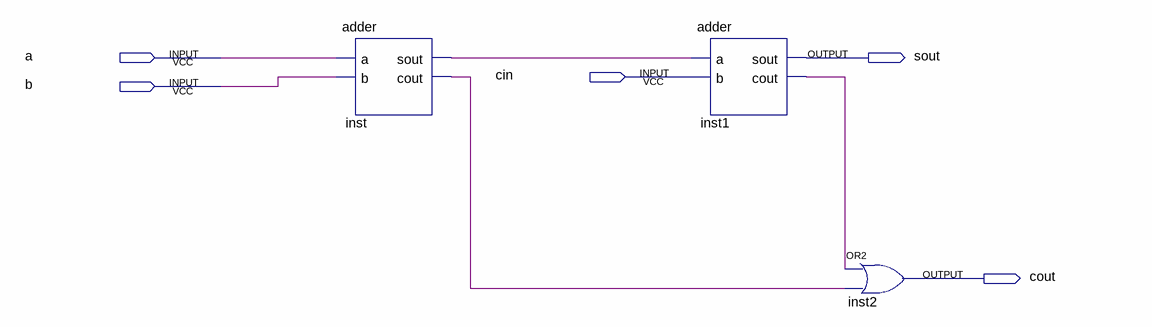
[diagram p0: schematic sheet]
// Quartus schematic f_adder.bdf as structural Verilog: 3 symbols, 5 pins
module f_adder (
  input  a,
  input  cin,
  input  b,
  output sout,
  output cout
);

  wire inst1_cout, inst_cout, inst_sout;

  adder inst (.a(a), .b(b), .sout(inst_sout), .cout(inst_cout));
  adder inst1 (.a(inst_sout), .b(cin), .sout(sout), .cout(inst1_cout));
  or inst2 (cout, inst1_cout, inst_cout);
endmodule
